# EAGLE design untitled (EAGLE 9.1.1)
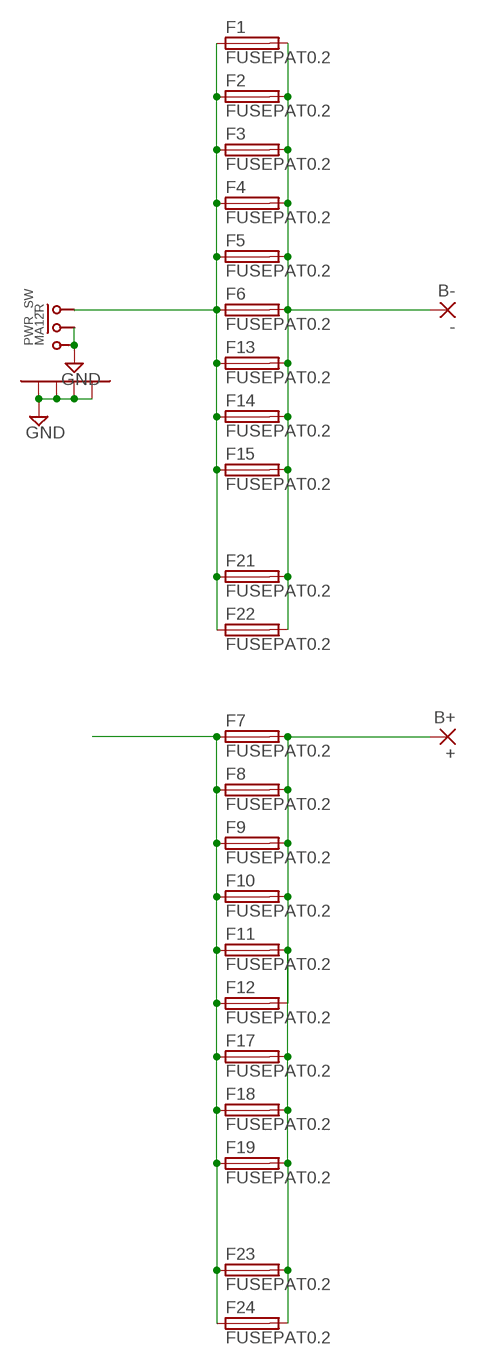
[diagram p0: schematic, sheet 1]

## Parts
B+  +  PAD2.5-5  [SMD2,5-5]
B-  -  PAD2.5-5  [SMD2,5-5]
F1  FUSEPAT0.2  [FUSE_PAT1]
F2  FUSEPAT0.2  [FUSE_PAT1]
F3  FUSEPAT0.2  [FUSE_PAT1]
F4  FUSEPAT0.2  [FUSE_PAT1]
F5  FUSEPAT0.2  [FUSE_PAT1]
F6  FUSEPAT0.2  [FUSE_PAT1]
F7  FUSEPAT0.2  [FUSE_PAT1]
F8  FUSEPAT0.2  [FUSE_PAT1]
F9  FUSEPAT0.2  [FUSE_PAT1]
F10  FUSEPAT0.2  [FUSE_PAT1]
F11  FUSEPAT0.2  [FUSE_PAT1]
F12  FUSEPAT0.2  [FUSE_PAT1]
F13  FUSEPAT0.2  [FUSE_PAT1]
F14  FUSEPAT0.2  [FUSE_PAT1]
F15  FUSEPAT0.2  [FUSE_PAT1]
F17  FUSEPAT0.2  [FUSE_PAT1]
F18  FUSEPAT0.2  [FUSE_PAT1]
F19  FUSEPAT0.2  [FUSE_PAT1]
F21  FUSEPAT0.2  [FUSE_PAT1]
F22  FUSEPAT0.2  [FUSE_PAT1]
F23  FUSEPAT0.2  [FUSE_PAT1]
F24  FUSEPAT0.2  [FUSE_PAT1]
PWR_SW  MA12R  [MA12R]

## Nets
GND: PWR_SW.P$2 PWR_SW.P$3 PWR_SW.P$4 PWR_SW.P$5 PWR_SW.P$6 PWR_SW.P$7
N$1: F1.P$1 F2.P$1 F3.P$1 F4.P$1 F5.P$1 F6.P$1 F13.P$1 F14.P$1 F15.P$1 F21.P$1 F22.P$1 PWR_SW.P$1
N$2: B-.1(P) F1.P$2 F2.P$2 F3.P$2 F4.P$2 F5.P$2 F6.P$2 F13.P$2 F14.P$2 F15.P$2 F21.P$2 F22.P$2
N$3: F7.P$1 F8.P$1 F9.P$1 F10.P$1 F11.P$1 F12.P$1 F17.P$1 F18.P$1 F19.P$1 F23.P$1 F24.P$1
N$4: B+.1(P) F7.P$2 F8.P$2 F9.P$2 F10.P$2 F11.P$2 F12.P$2 F17.P$2 F18.P$2 F19.P$2 F23.P$2 F24.P$2

## Library data of the parts
B+ B- = 0 my parts:PAD
F1-F15 F17-F19 F21-F24 = 3 FUSE:FUSE: Fuse
PWR_SW = 0 my parts:MA12R

## Board
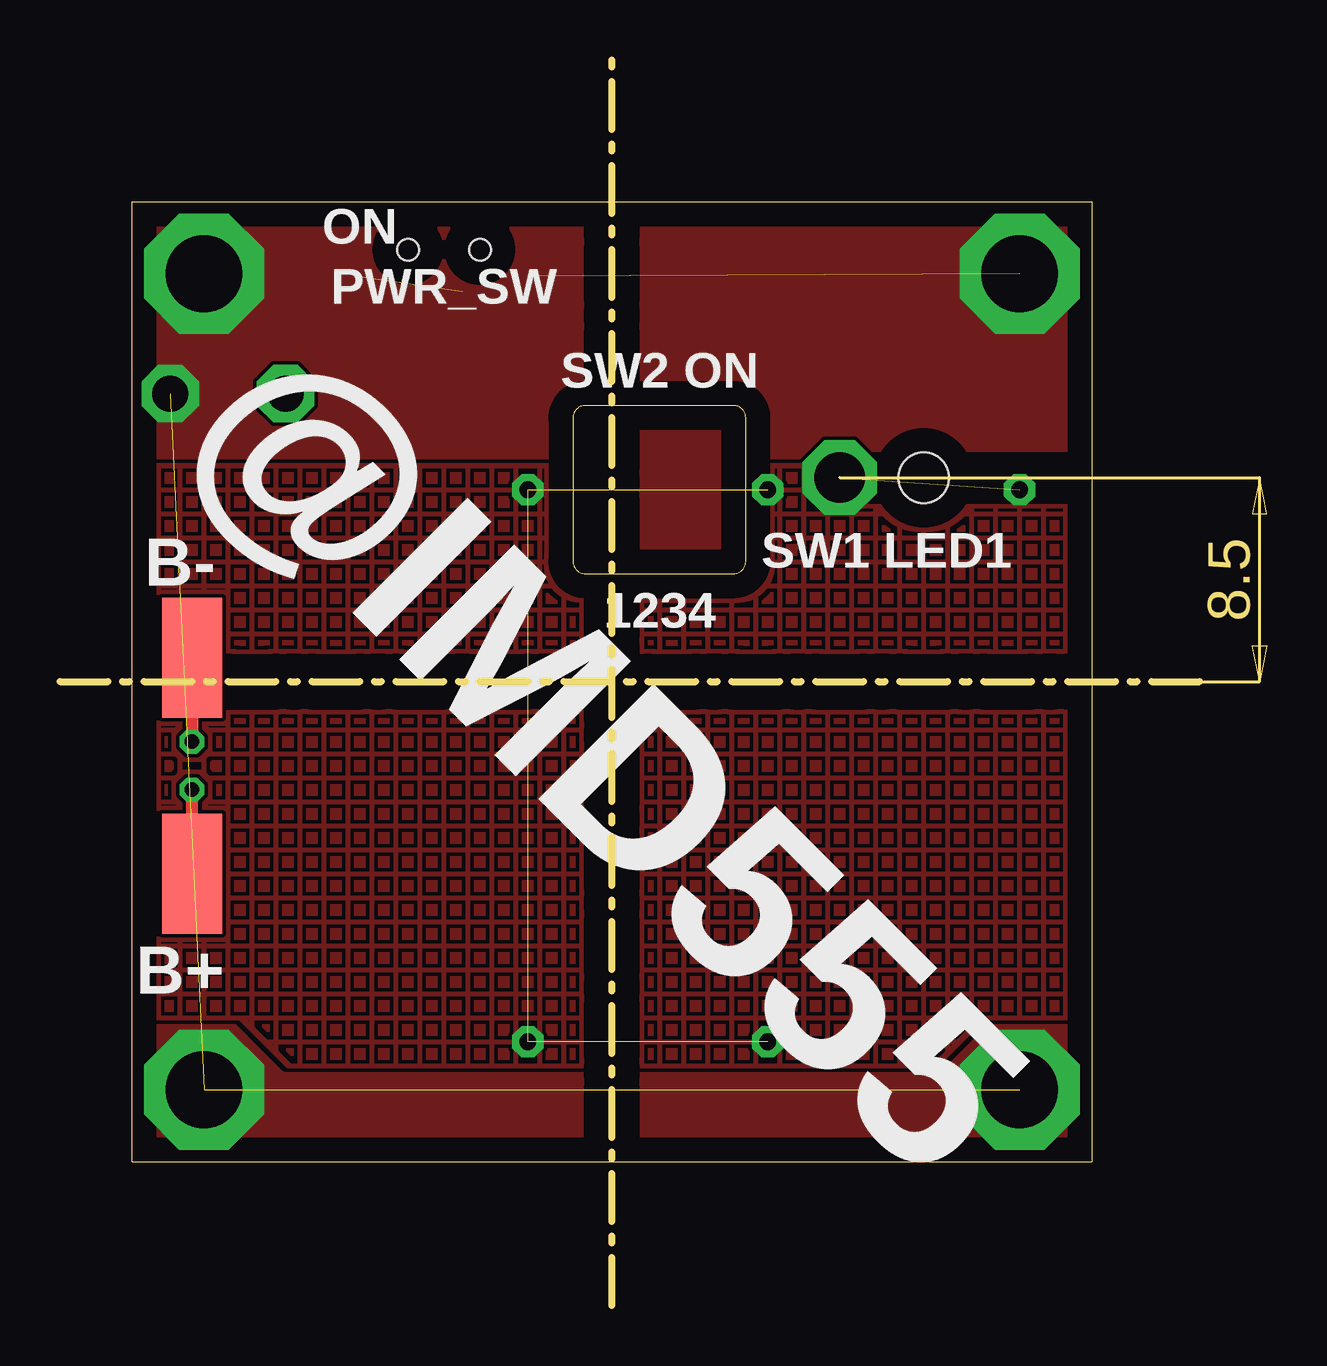
[diagram p1: board, top side]
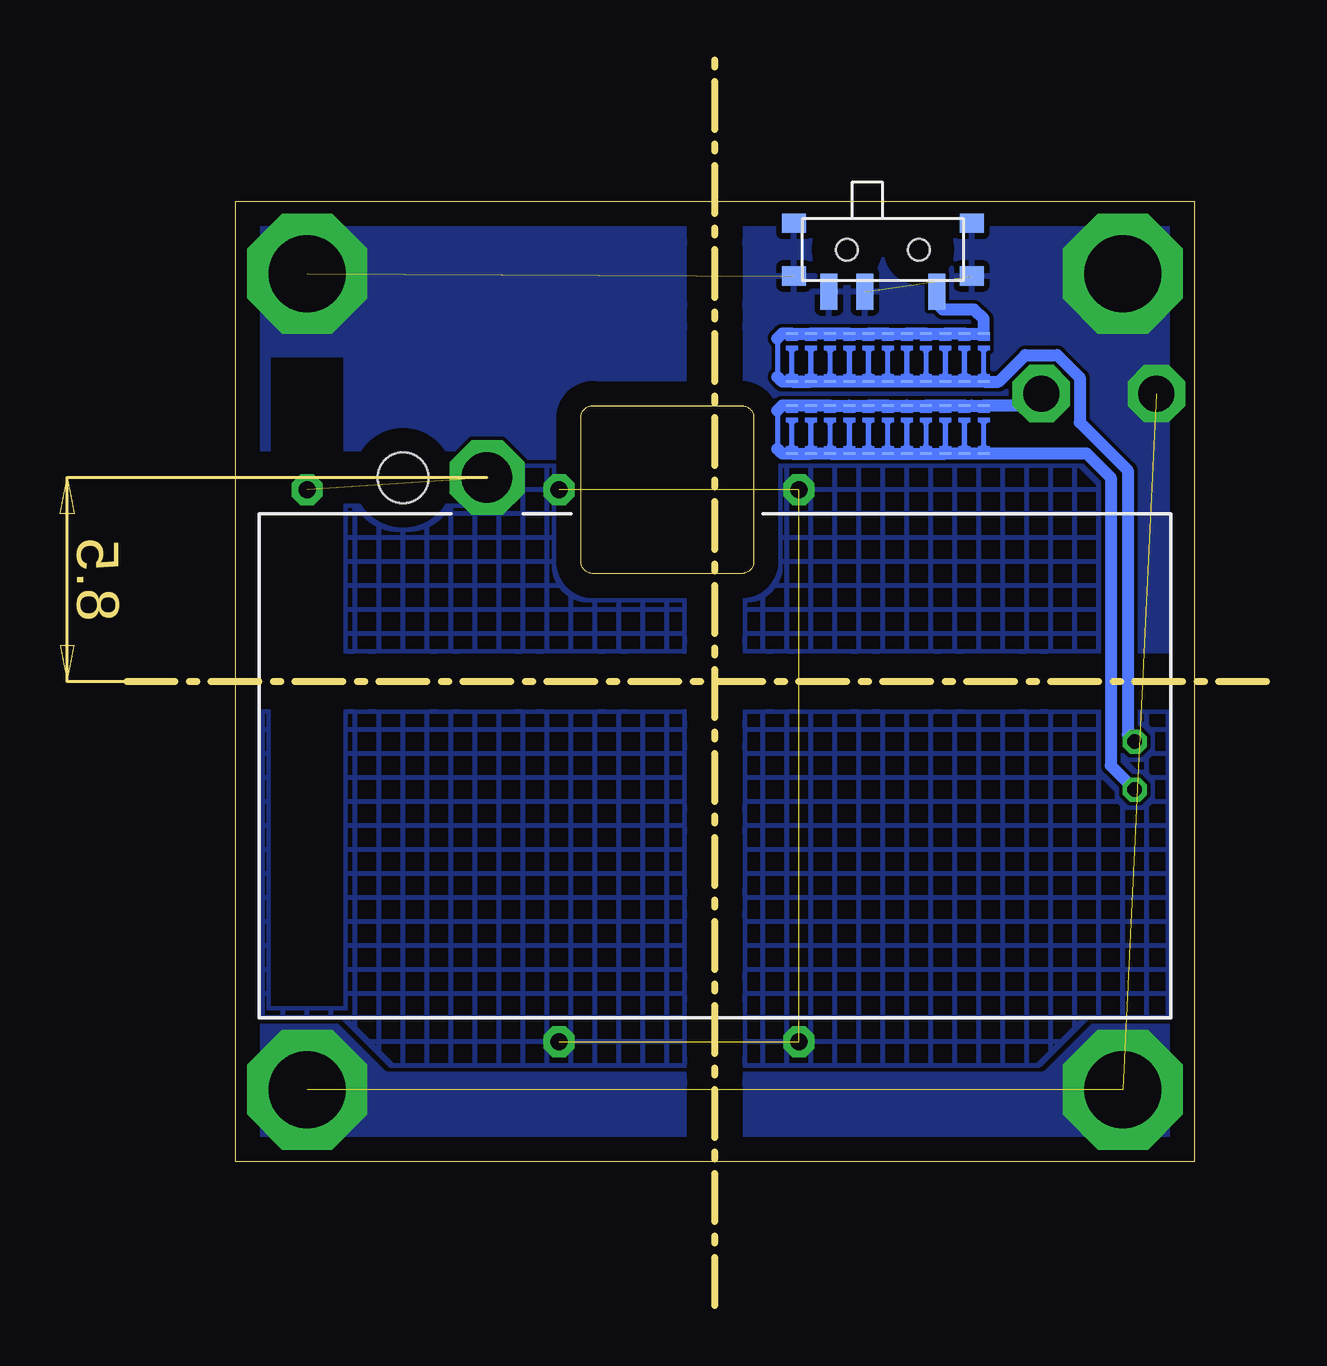
[diagram p2: board, bottom side, seen from below]

Size 47.5 x 51.9 mm. Coordinates in mm from the lower left corner, seen from the top.
Outline: 0,26 48,26
Outline: 23,0 23,52
Outline: 3,6 43,6 43,46 3,46 3,6
Outline: 21.39,37 21.39,31 arc90 21.89,30.5 28.09,30.5 arc90 28.59,31 28.59,37 arc90 28.09,37.5 21.89,37.5 arc90 21.39,37
Copper layers (1*16): Top 0.035mm / dielectric 1.5mm / Bottom 0.035mm
Design rules "default": minimum track width 6mil, minimum drill 0.35mm, track to track 6mil, track to pad 6mil, pad to pad 6mil, via to via 6mil, smd to smd 6mil, copper to edge 40mil, drill to drill 6mil, minimum pad ring 10mil, minimum via ring 8mil, stop-mask expansion 4mil, vias tented up to drill 0mil, thermal gap 10mil
Holes 2.1 mm at 36,34.5
bRestrict: area 38.5,12.5 to 41.5,39.5

### Footprints (pad centres in the part's own frame; a part is rotated, then mirrored left to right if it is on the bottom)
SMD2,5-5 = smd 2.5 x 5: 1 0,0
FUSE_PAT1 = smd 0.1 x 0.5: P$1 -1,0; P$2 1,0
MA12R = smd 0.7 x 1.5: P$1 -2.25,1.75; P$2 0.75,1.75; P$3 2.25,1.75 | smd 1 x 0.8: P$4 -3.7,1.1; P$5 -3.7,-1.1; P$6 3.7,-1.1; P$7 3.7,1.1 | hole 0.9: -1.5,0; 1.5,0

### Placement (x,y rotation side)
B+  5.5,18 0 top
B-  5.5,27 0 top
F1  18.2,39.5 270 bottom
F2  17.4,39.5 270 bottom
F3  16.6,39.5 270 bottom
F4  15.8,39.5 270 bottom
F5  15,39.5 270 bottom
F6  14.2,39.5 270 bottom
F7  18.2,36.5 270 bottom
F8  17.4,36.5 270 bottom
F9  16.6,36.5 270 bottom
F10  15.8,36.5 270 bottom
F11  15,36.5 270 bottom
F12  14.2,36.5 270 bottom
F13  13.4,39.5 270 bottom
F14  12.6,39.5 270 bottom
F15  11.8,39.5 270 bottom
F17  13.4,36.5 270 bottom
F18  12.6,36.5 270 bottom
F19  11.8,36.5 270 bottom
F21  19,39.5 270 bottom
F22  19.8,39.5 270 bottom
F23  19,36.5 270 bottom
F24  19.8,36.5 270 bottom
PWR_SW  16,44 180 bottom

### Tracks (layer width: path | path; a pad name or v marks a point on that pad's centre or on a via)
GND  (via drill 1.5 pad 2.4, 3.2 pad 5)  (4 unrouted)
  other vias: 6,43 40,43 40,9 6,9 4.6,38
  pour Bottom (rank 6): 3,46 43,46 43,6 3,6
  pour Top (rank 6): 3,46 43,46 43,6 3,6
GND3
  pour Top (rank 6): 3,46 43,46 43,6 3,6
N$1
  Bottom 0.2: 20.4,40.3 20.4,38.7
  Bottom 0.5: PWR_SW.P$1 13.75,41.75 13.5,41.5 12.2,41.5 11.8,41.1 F15.P$1 F14.P$1 F13.P$1 F6.P$1 F5.P$1 F4.P$1 F3.P$1 F2.P$1 F1.P$1 F21.P$1 F22.P$1 20.2,40.5 20.4,40.3
N$2  (via drill 0.6 pad 1)
  Top 0.5: B-.1 v5.5,23.5
  Bottom 0.5: v5.5,23.5 5.8,23.8 5.8,34.8 7.8,36.8 7.8,38.66 8.74,39.6 10.06,39.6 11.17,38.5 F15.P$2 F14.P$2 F13.P$2 F6.P$2 F5.P$2 F4.P$2 F3.P$2 F2.P$2 F1.P$2 F21.P$2 | F21.P$2 20.2,38.5 20.4,38.7 | F22.P$2 F21.P$2
N$3  (via drill 1.5 pad 2.4)
  Bottom 0.2: 20.4,37.3 20.4,35.7
  Bottom 0.5: 20.4,37.3 20.2,37.5 F24.P$1 F23.P$1 F7.P$1 F8.P$1 F9.P$1 F10.P$1 F11.P$1 F12.P$1 F17.P$1 F18.P$1 12.3,37.5 F19.P$1 9.9,37.5 v9.4,38
N$4  (via drill 0.6 pad 1)
  Top 0.5: B+.1 v5.5,21.5
  Bottom 0.5: v5.5,21.5 6.5,22.5 6.5,34.5 7.5,35.5 F19.P$2 F18.P$2 F17.P$2 F12.P$2 F11.P$2 F10.P$2 F9.P$2 F8.P$2 F7.P$2 F23.P$2 F24.P$2 20.2,35.5 20.4,35.7
N$5  (via drill 0.7 pad 1.3, 2.1 pad 3)  (4 unrouted)
  other vias: 19.5,34 29.5,34 19.5,11 29.5,11 40,34 32.5,34.5
  pour Top (hatched): 4,12 7.5,12 9.5,10 36.5,10 38.5,12 42,12 42,35 4,35
  pour Bottom (hatched): 4,12 7.5,12 9.5,10 36.5,10 38.5,12 42,12 42,35 4,35

### Text on the board
tPlace: ON | SW2 ON | SW1 | LED1 | 1234 | @IMD555
_tNames: PWR_SW | B- | B+